# EAGLE design opamp_prototype1 (EAGLE 7.5.0)
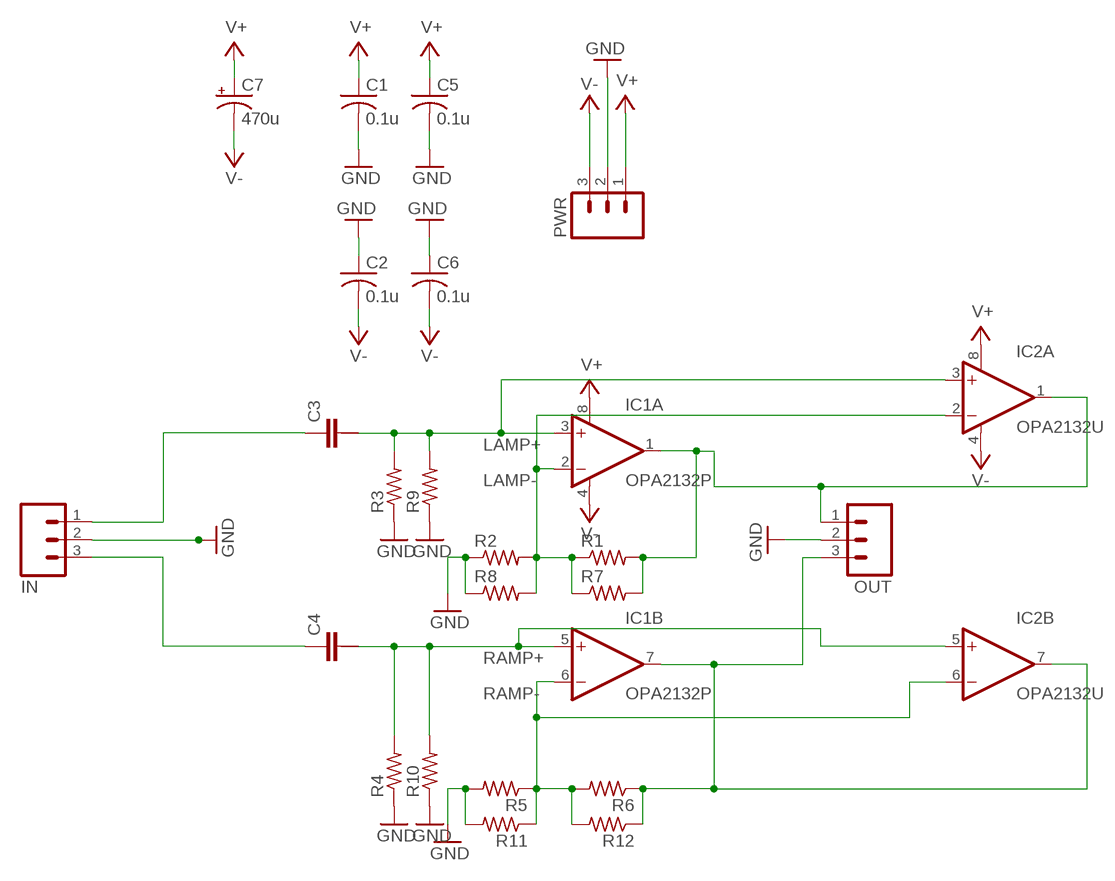
[diagram p0: schematic, sheet 1]

## Parts
C1  0.1u  C-USC0805K  [C0805K]
C2  0.1u  C-USC0805K  [C0805K]
C3  C-2.5-5/6  [C2.5/5-6]
C4  C-2.5-5/6  [C2.5/5-6]
C5  0.1u  C-USC0805K  [C0805K]
C6  0.1u  C-USC0805K  [C0805K]
C7  470u  CAP_POLPTH4  [CPOL-RADIAL-1000UF-25V]
IC1  OPA2132P  [DIL08]
IC2  OPA2132U  [SO08]
IN  M03PTH  [1X03]
OUT  M03PTH  [1X03]
PWR  M03PTH  [1X03]
R1  R-US_0207/10  [0207/10]
R2  R-US_0207/10  [0207/10]
R3  R-US_0207/10  [0207/10]
R4  R-US_0207/10  [0207/10]
R5  R-US_0207/10  [0207/10]
R6  R-US_0207/10  [0207/10]
R7  R-US_R1206  [R1206]
R8  R-US_R1206  [R1206]
R9  R-US_R1206  [R1206]
R10  R-US_R1206  [R1206]
R11  R-US_R1206  [R1206]
R12  R-US_R1206  [R1206]

## Nets
GND [power]: C1.2 C2.1 C5.2 C6.1 IN.2 OUT.2 PWR.2 R2.1 R3.1 R4.1 R5.2 R8.1 R9.1 R10.1 R11.2
IN_L: C3.1 IN.1
LAMP+: C3.2 IC1.3(A:+IN) IC2.3(A:+IN) R3.2 R9.2
LAMP-: IC1.2(A:-IN) IC2.2(A:-IN) R1.1 R2.2 R7.1 R8.2
N$3: C4.1 IN.3
OUT_L: IC1.1(A:OUT) IC2.1(A:OUT) OUT.1 R1.2 R7.2
OUT_R: IC1.7(B:OUT) IC2.7(B:OUT) OUT.3 R6.1 R12.1
RAMP+: C4.2 IC1.5(B:+IN) IC2.5(B:+IN) R4.2 R10.2
RAMP-: IC1.6(B:-IN) IC2.6(B:-IN) R5.1 R6.2 R11.1 R12.2
V+ [power]: C1.1 C5.1 C7.+ IC1.8(A:V+) IC2.8(A:V+) PWR.1
V- [power]: C2.2 C6.2 C7.- IC1.4(A:V-) IC2.4(A:V-) PWR.3
Unconnected: C3.3 C4.3

## Library data of the parts
C1 C2 C5 C6 = adafruit:C-US: CAPACITOR, American symbol
C3 C4 = capacitor-wima:C-: CAPACITOR for alternative placement naming: default grid - extended grid/package width
C7 = SparkFun-Capacitors:CAP_POL: Capacitor Polarized These are standard SMD and PTH capacitors. Normally 10uF, 47uF, and 100uF in electrolytic and tantalum varieties. Always verify the external diameter of the through hole cap, it varies with capacity, voltage, and manufacturer. The EIA devices should be standard.
IC1 = burr-brown:OPA2132: High Speed FET-Input Operational Amplifiers< Product Folder:OPA2132; MPN: OPA2132P; OC_FARNELL: 1212432; OC_NEWARK: 47P7461
IC2 = burr-brown:OPA2132: High Speed FET-Input Operational Amplifiers< Product Folder:OPA2132; MF: TEXAS INSTRUMENTS; MPN: OPA2132U; OC_FARNELL: 1206934; OC_NEWARK: 80K6015
IN OUT PWR = SparkFun-Connectors:M03: Header 3 Standard 3-pin 0.1" header. Use with straight break away headers (SKU : PRT-00116), right angle break away headers (PRT-00553), swiss pins (PRT-00743), machine pins (PRT-00117), and female headers (PRT-00115). Molex polarized connector foot print use with SKU : PRT-08232 with associated crimp pins and housings.
R1-R6 = adafruit:R-US_: RESISTOR, American symbol
R7-R12 = rcl:R-US_: RESISTOR, American symbol

## Net classes
0 default: width 0.381 mm, clearance 0.381 mm
1 power: width 0.381 mm, clearance 0.508 mm

## Board
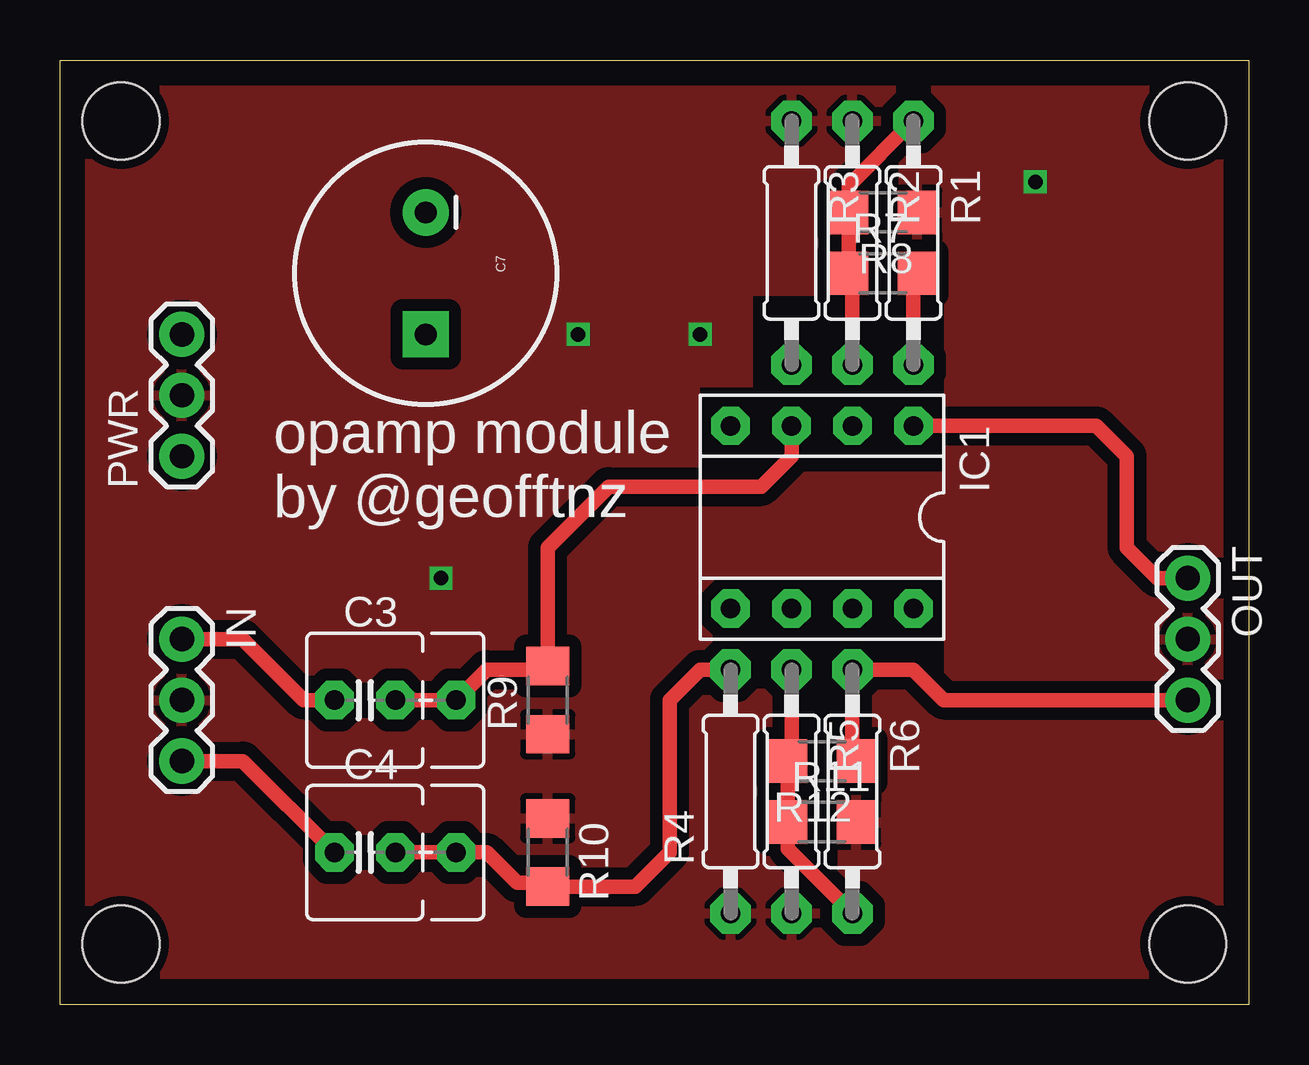
[diagram p1: board, top side]
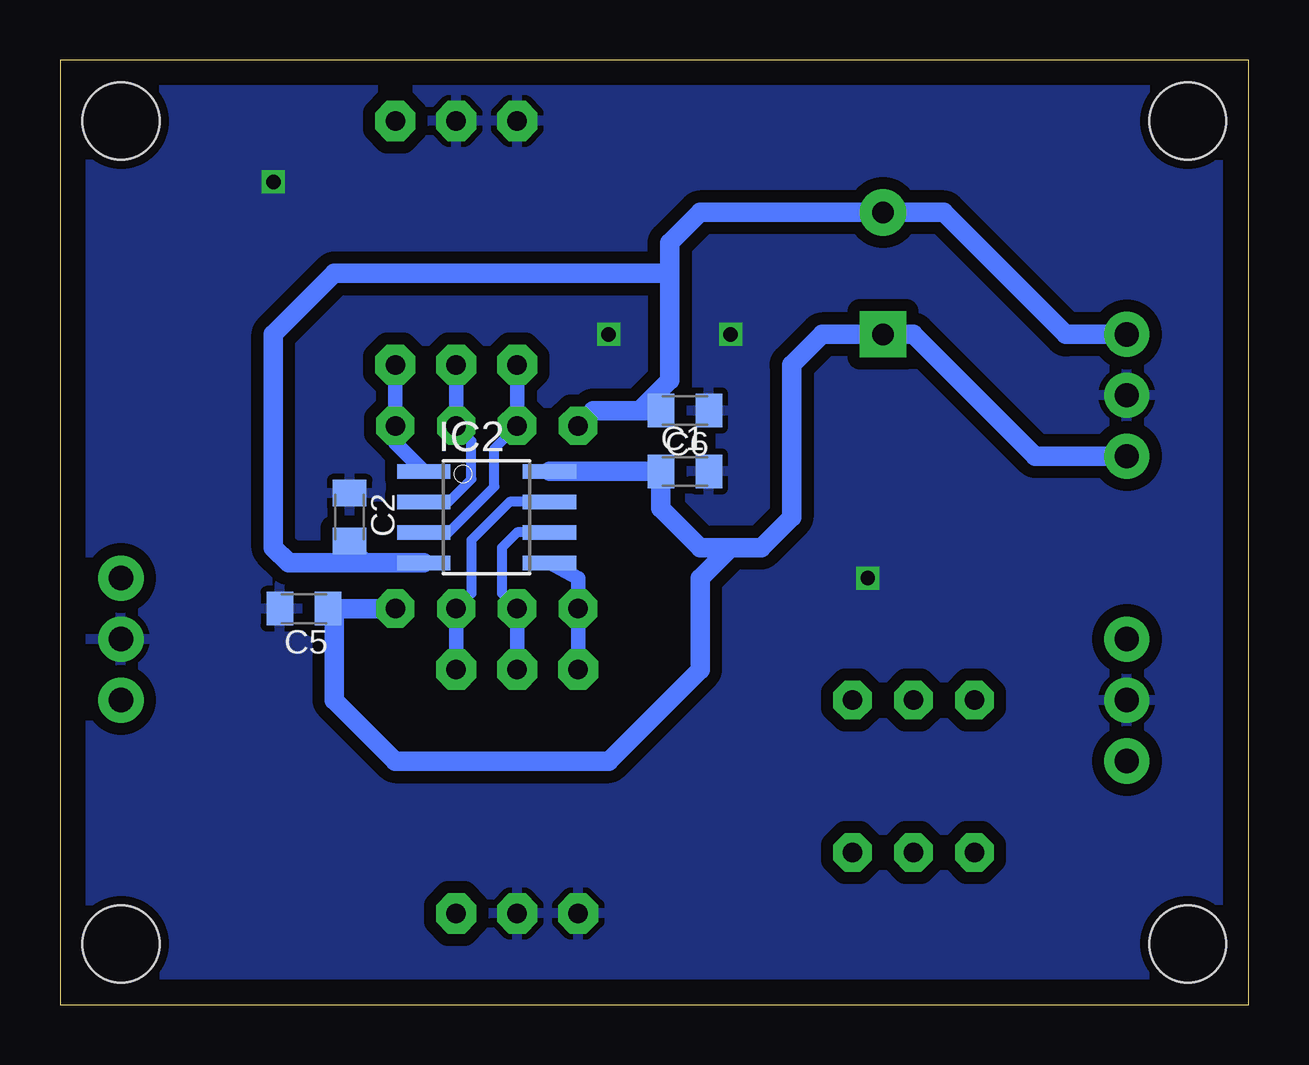
[diagram p2: board, bottom side, seen from below]

Size 49.53 x 39.37 mm. Coordinates in mm from the lower left corner, seen from the top.
Outline: 0,0 0,39.37 49.53,39.37 49.53,0 0,0
Copper layers (1*16): Top 0.0356mm / dielectric 1.5011mm / Bottom 0.0356mm
Design rules "LaenPCBOrder": minimum track width 6mil, minimum drill 13mil, track to track 6mil, track to pad 6mil, pad to pad 6mil, via to via 6mil, smd to smd 6mil, copper to edge 15mil, drill to drill 6mil, minimum pad ring 7mil, minimum via ring 7mil, stop-mask expansion 3mil, vias tented up to drill 0mil, thermal gap 10mil
Holes 3.2 mm at 2.54,2.54 46.99,2.54 46.99,36.83 2.54,36.83
tRestrict: area 34,30.8 to 34.9,35.2; area 31.1,5.7 to 32.4,9.5; area 26.7,22.2 to 36.8,25.7; area 28.9,25.7 to 36.8,29.5; area 27.9,13.7 to 36.8,17.8
bRestrict: area 22.2,22.9 to 26.7,24.1; area 24.1,20.3 to 27.9,21.6; area 35.9,20 to 36.5,21; area 26.4,16.2 to 27.9,20.3

### Footprints (pad centres in the part's own frame; a part is rotated, then mirrored left to right if it is on the bottom)
C0805K = smd 1.1 x 1.4: 1 -1,0; 2 1,0
C2.5/5-6 = drill 0.813 pad 1.6 octagon: 1 -1.27,0; 2 1.27,0; 3 3.81,0
CPOL-RADIAL-1000UF-25V = drill 0.9 pad 1.93 square: + 2.54,0 | drill 0.9 pad 1.93: - -2.54,0
DIL08 = drill 0.813 pad 1.6 octagon: 1 -3.81,-3.81; 2 -1.27,-3.81; 3 1.27,-3.81; 4 3.81,-3.81; 5 3.81,3.81; 6 1.27,3.81; 7 -1.27,3.81; 8 -3.81,3.81
SO08 = smd 0.61 x 2.21: 1 -1.905,-2.616; 2 -0.635,-2.616; 3 0.635,-2.616; 4 1.905,-2.616; 5 1.905,2.616; 6 0.635,2.616; 7 -0.635,2.616; 8 -1.905,2.616
1X03 = drill 1.016 pad 1.88: 1 0,0; 2 2.54,0; 3 5.08,0
0207/10 = drill 0.813 pad 1.676 octagon: 1 -5.08,0; 2 5.08,0
R1206 = smd 1.6 x 1.803: 1 -1.422,0; 2 1.422,0

### Placement (x,y rotation side)
C1  23.5,22.23 0 bottom
C2  37.47,20.32 270 bottom
C3  12.7,12.7 0 top
C4  12.7,6.35 0 top
C5  39.37,16.51 180 bottom
C6  23.5,24.77 180 bottom
C7  15.24,30.48 270 top
IC1  31.75,20.32 180 top
IC2  31.75,20.32 270 bottom
IN  5.08,15.24 270 top
OUT  46.99,17.78 270 top
PWR  5.08,22.86 90 top
R1  35.56,31.75 270 top
R2  33.02,31.75 270 top
R3  30.48,31.75 270 top
R4  27.94,8.89 90 top
R5  30.48,8.89 270 top
R6  33.02,8.89 270 top
R7  34.29,30.48 0 top
R8  34.29,33.02 180 top
R9  20.32,12.7 90 top
R10  20.32,6.35 270 top
R11  31.75,7.62 0 top
R12  31.75,10.16 180 top

### Tracks (layer width: path | path; a pad name or v marks a point on that pad's centre or on a via)
GND  (via drill 0.6)
  other vias: 40.64,34.29 15.88,17.78 21.59,27.94 26.67,27.94
  pour Bottom: 1.27,38.1 48.26,38.1 48.26,1.27 1.27,1.27
  pour Top: 1.27,38.1 48.26,38.1 48.26,36.83 48.26,1.27 1.27,1.27
IN_L
  Top 0.61: IN.1 7.62,15.24 10.16,12.7 C3.1
LAMP+
  Top 0.61: C3.2 16.51,12.7 17.78,13.97 20.17,13.97 R9.2 20.32,19.05 22.86,21.59 29.21,21.59 30.48,22.86 IC1.3
  Bottom 0.406: IC2.3 33.34,19.68 31.43,21.59 31.43,23.18 IC1.3
  Bottom 0.61: R3.2 IC1.3
LAMP-
  Top 0.61: R2.2 33.02,30.33 R7.1 R8.2 32.87,34.14 R1.1
  Bottom 0.406: IC2.2 33.34,20.95 32.38,21.91 32.38,23.5 IC1.2
  Bottom 0.61: IC1.2 R2.2
N$3
  Top 0.61: IN.3 7.62,10.16 C4.1
OUT_L
  Top 0.61: IC1.1 43.18,24.13 44.45,22.86 44.45,19.05 45.72,17.78 OUT.1 | R1.2 35.56,30.33 R7.2
  Bottom 0.61: R1.2 IC1.1 35.56,23.42 IC2.1
OUT_R
  Top 0.61: OUT.3 36.83,12.7 35.56,13.97 R6.1 33.02,10.31 R12.1
  Bottom 0.406: IC2.7 30.8,20.95 32.38,19.37 32.38,17.14 IC1.7
  Bottom 0.61: IC1.7 R6.1
RAMP+
  Top 0.61: C4.2 17.78,6.35 19.05,5.08 20.17,5.08 R10.2 23.98,4.93 25.4,6.35 25.4,12.7 26.67,13.97 R4.2
  Bottom 0.61: IC2.5 27.94,17.78 IC1.5 R4.2
RAMP-
  Top 0.61: R5.1 30.48,10.31 R12.2 R11.1 30.33,6.5 R6.2
  Bottom 0.406: IC2.6 30.48,19.68 31.11,19.05 31.11,17.14 IC1.6
  Bottom 0.61: IC1.6 R5.1
V+
  Bottom 0.813: 38.1,16.51 C5.1 | PWR.1 8.89,22.86 13.97,27.94 C7.+ 17.78,27.94 19.05,26.67 19.05,20.32 20.32,19.05 21.59,19.05 | 21.59,19.05 22.86,19.05 24.5,20.68 C1.1 IC2.8 | IC1.8 38.1,16.51 | 38.1,16.51 38.1,12.7 35.56,10.16 26.67,10.16 22.86,13.97 22.86,17.78 21.59,19.05
V-
  Bottom 0.813: C6.2 25.4,24.77 | 25.4,24.77 27.3,24.77 IC1.4 | 24.13,30.48 24.13,31.75 22.86,33.02 C7.- 12.7,33.02 7.62,27.94 PWR.3 | 24.13,30.48 24.13,26.04 25.4,24.77 | C2.2 37.47,19.05 36.83,18.41 IC2.4 40.01,18.41 40.64,19.05 40.64,27.94 38.1,30.48 24.13,30.48

### Text on the board
tSilk: opamp module / by @geofftnz